# Altium schematic sheet 14. SOC EMIF2 & LPDDR4.SchDoc: LPDDR4 INTERFACE - 3 (part 1 of 2)
size 513 x 386 mm; Project: PROC154E2(001)_SK_AM69; Issue: 1.0; RevCode: E3; Page Create Date: March  8, 1995; Variant Name: Core Design; Schematic Page Number: 14; Page Number: 14; Page Size: C; Comment: MISTRAL_TITLEBLK_CSIZE_1; Page Count: 62; Schematic Page Count: 62; Name: PROC154E2 001 SK AM69; DsnPath: C:\Users\danie\Downloads\sprr466c\PROC154E3_RP\PROC154E3_SCH.DSN; SchematicName: SCHEMATIC1; PageName: 14. SOC EMIF2 & LPDDR4; PageSize: C; TopSchematic: True
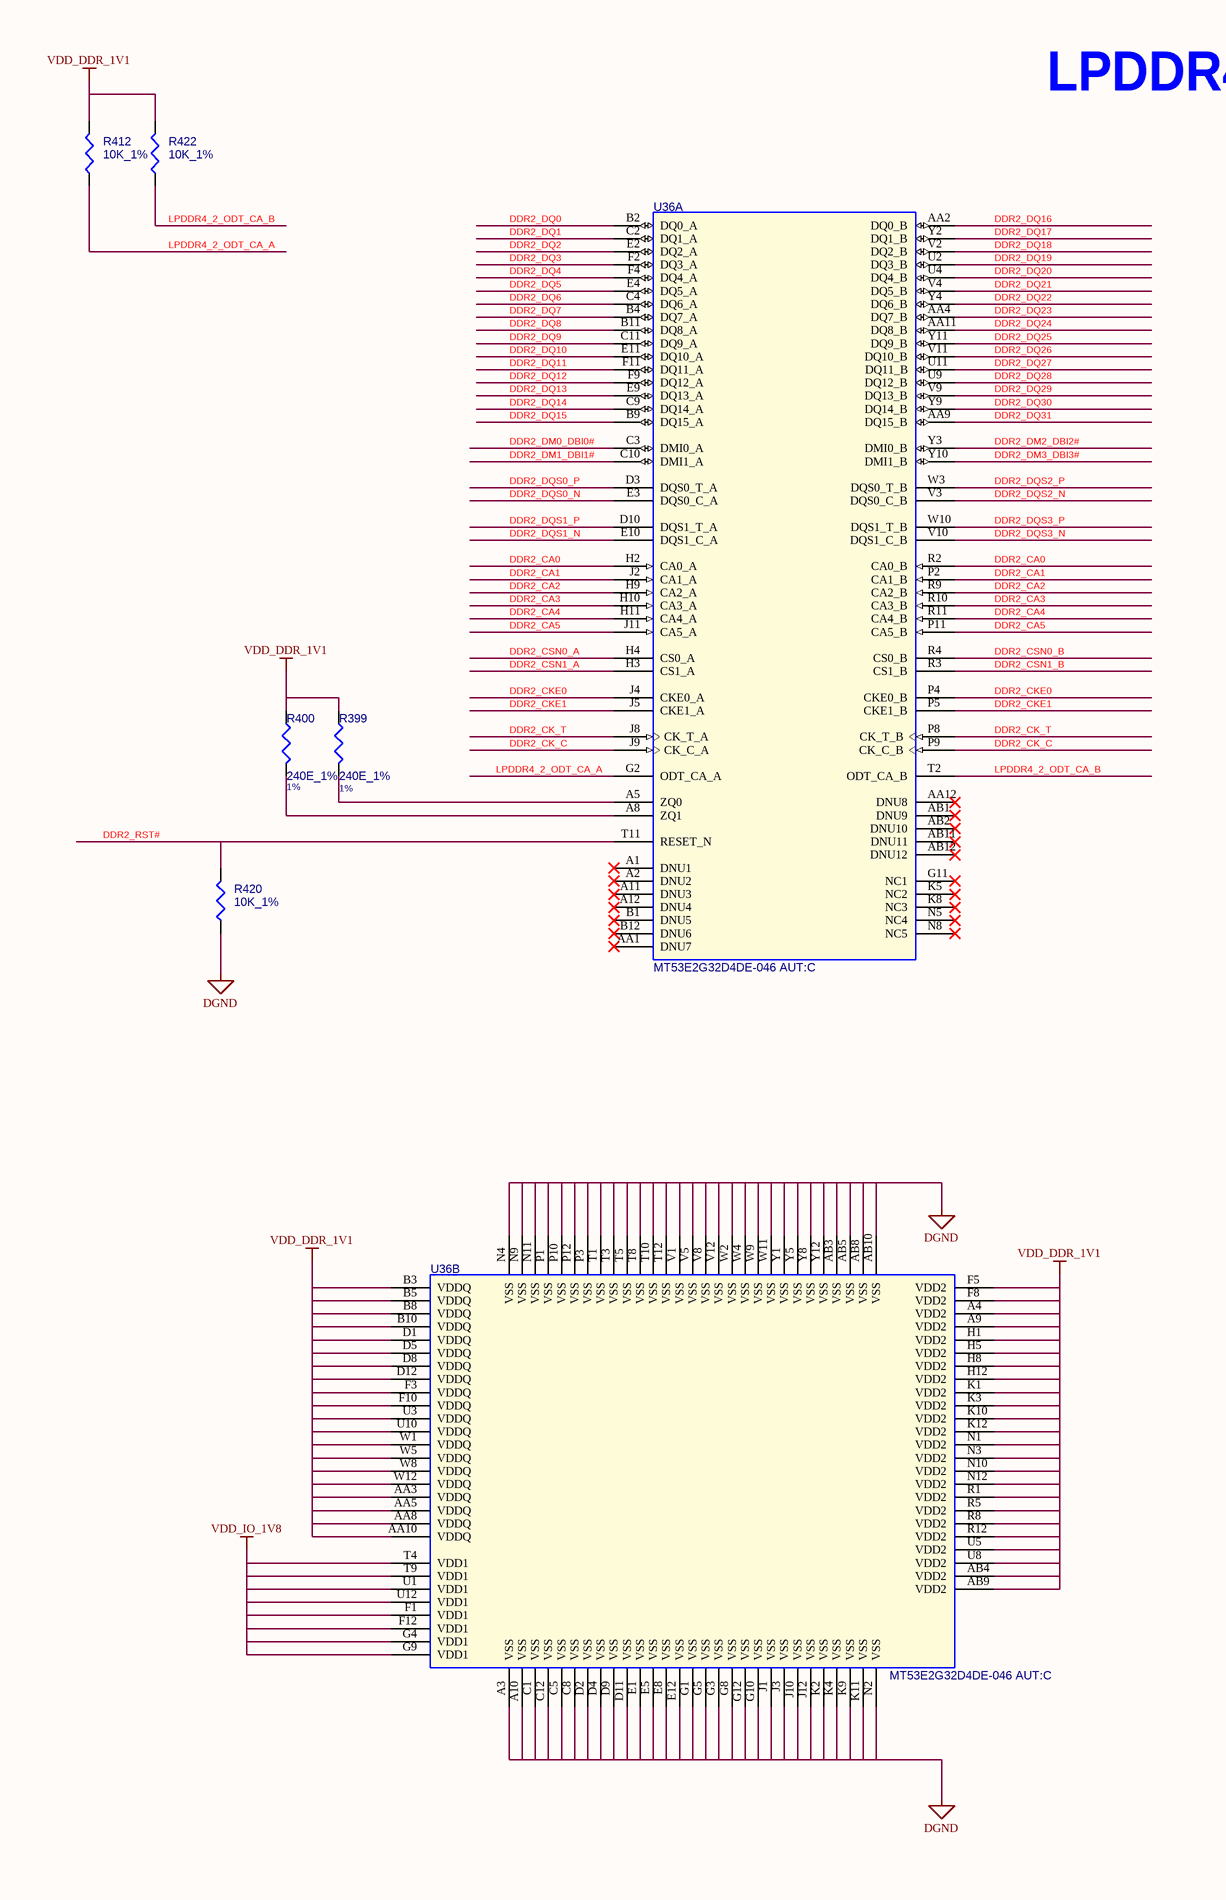
[diagram p0: 14. SOC EMIF2 & LPDDR4.SchDoc, left]
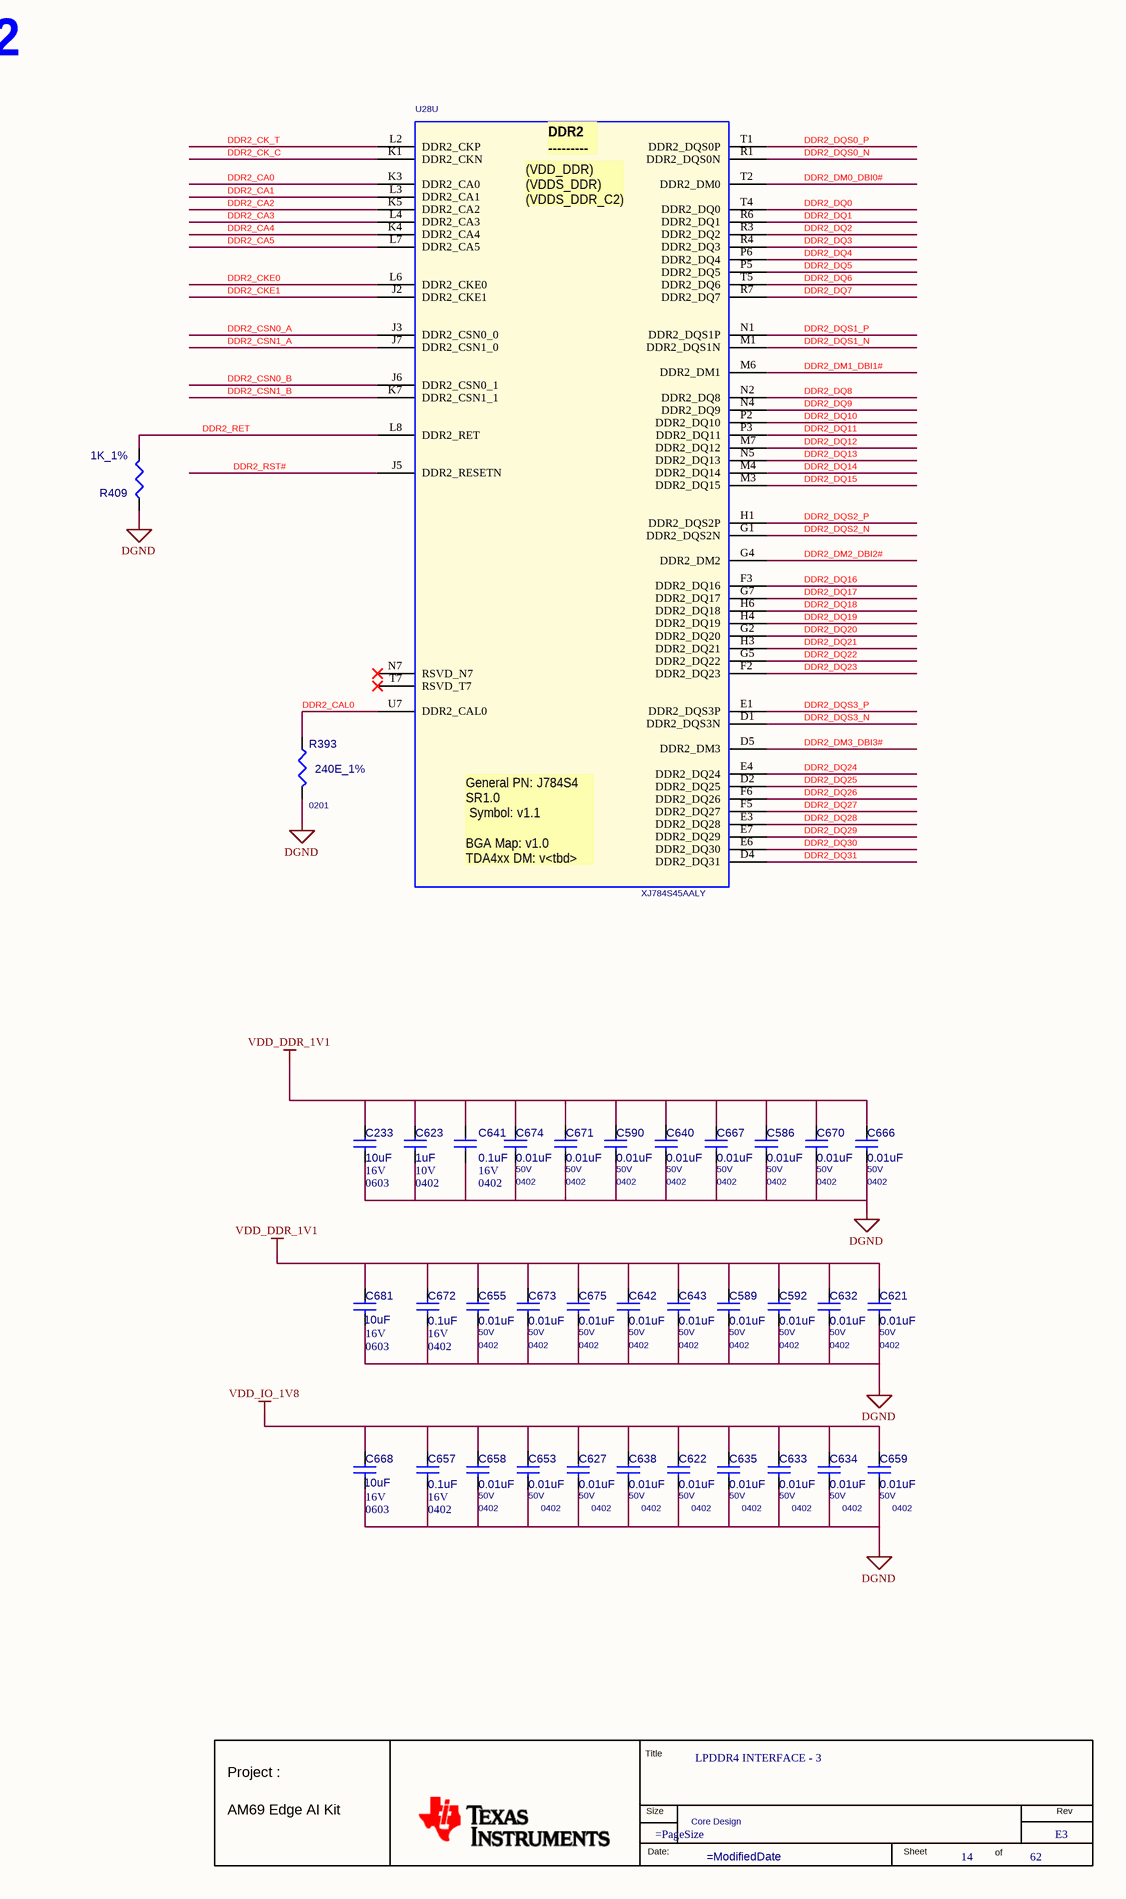
[diagram p1: 14. SOC EMIF2 & LPDDR4.SchDoc, right]

## Parts
*  RevCode: E3  Title: LPDDR4 INTERFACE - 3  Page Number: 14  Page Count: 62  Variant Name: Core Design  (hidden comment: MISTRAL_TITLEBLK_CSIZE_1)  (graphical)
C233  10uF  Package: 0603  Voltage: 16V  [CAP0603_1]
C586  0.01uF  Voltage: 50V  Package: 0402  [CAP0402_0-75]
C589  0.01uF  Voltage: 50V  Package: 0402  [CAP0402_0-75]
C590  0.01uF  Voltage: 50V  Package: 0402  [CAP0402_0-75]
C592  0.01uF  Package: 0402  Voltage: 50V  [CAP0402_0-75]
C621  0.01uF  Package: 0402  Voltage: 50V  [CAP0402_0-75]
C622  0.01uF  Voltage: 50V  Package: 0402  [CAP0402_0-75]
C623  1uF  Voltage: 10V  Package: 0402  [CAP0402_0-75]
C627  0.01uF  Package: 0402  Voltage: 50V  [CAP0402_0-75]
C632  0.01uF  Voltage: 50V  Package: 0402  [CAP0402_0-75]
C633  0.01uF  Voltage: 50V  Package: 0402  [CAP0402_0-75]
C634  0.01uF  Package: 0402  Voltage: 50V  [CAP0402_0-75]
C635  0.01uF  Package: 0402  Voltage: 50V  [CAP0402_0-75]
C638  0.01uF  Package: 0402  Voltage: 50V  [CAP0402_0-75]
C640  0.01uF  Voltage: 50V  Package: 0402  [CAP0402_0-75]
C641  0.1uF  Voltage: 16V  Package: 0402  [CAP0402_0-75]
C642  0.01uF  Package: 0402  Voltage: 50V  [CAP0402_0-75]
C643  0.01uF  Voltage: 50V  Package: 0402  [CAP0402_0-75]
C653  0.01uF  Package: 0402  Voltage: 50V  [CAP0402_0-75]
C655  0.01uF  Package: 0402  Voltage: 50V  [CAP0402_0-75]
C657  0.1uF  Voltage: 16V  Package: 0402  [CAP0402_0-75]
C658  0.01uF  Voltage: 50V  Package: 0402  [CAP0402_0-75]
C659  0.01uF  Voltage: 50V  Package: 0402  [CAP0402_0-75]
C666  0.01uF  Package: 0402  Voltage: 50V  [CAP0402_0-75]
C667  0.01uF  Voltage: 50V  Package: 0402  [CAP0402_0-75]
C668  10uF  Voltage: 16V  Package: 0603  [CAP0603_1]
C670  0.01uF  Voltage: 50V  Package: 0402  [CAP0402_0-75]
C671  0.01uF  Voltage: 50V  Package: 0402  [CAP0402_0-75]
C672  0.1uF  Package: 0402  Voltage: 16V  [CAP0402_0-75]
C673  0.01uF  Package: 0402  Voltage: 50V  [CAP0402_0-75]
C674  0.01uF  Package: 0402  Voltage: 50V  [CAP0402_0-75]
C675  0.01uF  Package: 0402  Voltage: 50V  [CAP0402_0-75]
C681  10uF  Voltage: 16V  Package: 0603  [CAP0603_1]
R393  240E_1%  Package: 0201  [RES0201_0-5]
R399  240E_1%  Tolerance: 1%  [RES0201_0-5]
R400  240E_1%  Tolerance: 1%  [RES0201_0-5]
R409  1K_1%  [RES0402_0-5]
R412  10K_1%  [RES0402_0-5]
R420  10K_1%  [RES0402_0-5]
R422  10K_1%  [RES0402_0-5]
U28  XJ784S45AALY  [BGA1414_31-49_1230X1230_2-7]  (part U of 26)
U36  MT53E2G32D4DE-046 AUT:C  [WFBGA200_MT53DDS_400X570_1-2]  (parts A,B of 2)

## Nets
DGND: C233.2 C586.2 C589.2 C590.2 C592.2 C621.2 C622.2 C623.2 C627.2 C632.2 C633.2 C634.2 C635.2 C638.2 C640.2 C641.2 C642.2 C643.2 C653.2 C655.2 C657.2 C658.2 C659.2 C666.2 C667.2 C668.2 C670.2 C671.2 C672.2 C673.2 C674.2 C675.2 C681.2 R393.2 R409.2 R420.1 U36.A3(VSS) U36.A10(VSS) U36.AB3(VSS) U36.AB5(VSS) U36.AB8(VSS) U36.AB10(VSS) U36.C1(VSS) U36.C5(VSS) U36.C8(VSS) U36.C12(VSS) U36.D2(VSS) U36.D4(VSS) U36.D9(VSS) U36.D11(VSS) U36.E1(VSS) U36.E5(VSS) U36.E8(VSS) U36.E12(VSS) U36.G1(VSS) U36.G3(VSS) U36.G5(VSS) U36.G8(VSS) U36.G10(VSS) U36.G12(VSS) U36.J1(VSS) U36.J3(VSS) U36.J10(VSS) U36.J12(VSS) U36.K2(VSS) U36.K4(VSS) U36.K9(VSS) U36.K11(VSS) U36.N2(VSS) U36.N4(VSS) U36.N9(VSS) U36.N11(VSS) U36.P1(VSS) U36.P3(VSS) U36.P10(VSS) U36.P12(VSS) U36.T1(VSS) U36.T3(VSS) U36.T5(VSS) U36.T8(VSS) U36.T10(VSS) U36.T12(VSS) U36.V1(VSS) U36.V5(VSS) U36.V8(VSS) U36.V12(VSS) U36.W2(VSS) U36.W4(VSS) U36.W9(VSS) U36.W11(VSS) U36.Y1(VSS) U36.Y5(VSS) U36.Y8(VSS) U36.Y12(VSS)
VDD_DDR_1V1: C233.1 C586.1 C589.1 C590.1 C592.1 C621.1 C623.1 C632.1 C640.1 C641.1 C642.1 C643.1 C655.1 C666.1 C667.1 C670.1 C671.1 C672.1 C673.1 C674.1 C675.1 C681.1 R399.1 R400.1 R412.2 R422.2 U36.A4(VDD2) U36.A9(VDD2) U36.AA3(VDDQ) U36.AA5(VDDQ) U36.AA8(VDDQ) U36.AA10(VDDQ) U36.AB4(VDD2) U36.AB9(VDD2) U36.B3(VDDQ) U36.B5(VDDQ) U36.B8(VDDQ) U36.B10(VDDQ) U36.D1(VDDQ) U36.D5(VDDQ) U36.D8(VDDQ) U36.D12(VDDQ) U36.F3(VDDQ) U36.F5(VDD2) U36.F8(VDD2) U36.F10(VDDQ) U36.H1(VDD2) U36.H5(VDD2) U36.H8(VDD2) U36.H12(VDD2) U36.K1(VDD2) U36.K3(VDD2) U36.K10(VDD2) U36.K12(VDD2) U36.N1(VDD2) U36.N3(VDD2) U36.N10(VDD2) U36.N12(VDD2) U36.R1(VDD2) U36.R5(VDD2) U36.R8(VDD2) U36.R12(VDD2) U36.U3(VDDQ) U36.U5(VDD2) U36.U8(VDD2) U36.U10(VDDQ) U36.W1(VDDQ) U36.W5(VDDQ) U36.W8(VDDQ) U36.W12(VDDQ)
VDD_IO_1V8: C622.1 C627.1 C633.1 C634.1 C635.1 C638.1 C653.1 C657.1 C658.1 C659.1 C668.1 U36.F1(VDD1) U36.F12(VDD1) U36.G4(VDD1) U36.G9(VDD1) U36.T4(VDD1) U36.T9(VDD1) U36.U1(VDD1) U36.U12(VDD1)
DDR2_CA0: U28.K3(DDR2_CA0) U36.H2(CA0_A) U36.R2(CA0_B)
DDR2_CA1: U28.L3(DDR2_CA1) U36.J2(CA1_A) U36.P2(CA1_B)
DDR2_CA2: U28.K5(DDR2_CA2) U36.H9(CA2_A) U36.R9(CA2_B)
DDR2_CA3: U28.L4(DDR2_CA3) U36.H10(CA3_A) U36.R10(CA3_B)
DDR2_CA4: U28.K4(DDR2_CA4) U36.H11(CA4_A) U36.R11(CA4_B)
DDR2_CA5: U28.L7(DDR2_CA5) U36.J11(CA5_A) U36.P11(CA5_B)
DDR2_CAL0: R393.1 U28.U7(DDR2_CAL0)
DDR2_CK_C: U28.K1(DDR2_CKN) U36.J9(CK_C_A) U36.P9(CK_C_B)
DDR2_CK_T: U28.L2(DDR2_CKP) U36.J8(CK_T_A) U36.P8(CK_T_B)
DDR2_CKE0: U28.L6(DDR2_CKE0) U36.J4(CKE0_A) U36.P4(CKE0_B)
DDR2_CKE1: U28.J2(DDR2_CKE1) U36.J5(CKE1_A) U36.P5(CKE1_B)
DDR2_CSN0_A: U28.J3(DDR2_CSN0_0) U36.H4(CS0_A)
DDR2_CSN0_B: U28.J6(DDR2_CSN0_1) U36.R4(CS0_B)
DDR2_CSN1_A: U28.J7(DDR2_CSN1_0) U36.H3(CS1_A)
DDR2_CSN1_B: U28.K7(DDR2_CSN1_1) U36.R3(CS1_B)
DDR2_DM0_DBI0#: U28.T2(DDR2_DM0) U36.C3(DMI0_A)
DDR2_DM1_DBI1#: U28.M6(DDR2_DM1) U36.C10(DMI1_A)
DDR2_DM2_DBI2#: U28.G4(DDR2_DM2) U36.Y3(DMI0_B)
DDR2_DM3_DBI3#: U28.D5(DDR2_DM3) U36.Y10(DMI1_B)
DDR2_DQ0: U28.T4(DDR2_DQ0) U36.B2(DQ0_A)
DDR2_DQ1: U28.R6(DDR2_DQ1) U36.C2(DQ1_A)
DDR2_DQ2: U28.R3(DDR2_DQ2) U36.E2(DQ2_A)
DDR2_DQ3: U28.R4(DDR2_DQ3) U36.F2(DQ3_A)
DDR2_DQ4: U28.P6(DDR2_DQ4) U36.F4(DQ4_A)
DDR2_DQ5: U28.P5(DDR2_DQ5) U36.E4(DQ5_A)
DDR2_DQ6: U28.T5(DDR2_DQ6) U36.C4(DQ6_A)
DDR2_DQ7: U28.R7(DDR2_DQ7) U36.B4(DQ7_A)
DDR2_DQ8: U28.N2(DDR2_DQ8) U36.B11(DQ8_A)
DDR2_DQ9: U28.N4(DDR2_DQ9) U36.C11(DQ9_A)
DDR2_DQ10: U28.P2(DDR2_DQ10) U36.E11(DQ10_A)
DDR2_DQ11: U28.P3(DDR2_DQ11) U36.F11(DQ11_A)
DDR2_DQ12: U28.M7(DDR2_DQ12) U36.F9(DQ12_A)
DDR2_DQ13: U28.N5(DDR2_DQ13) U36.E9(DQ13_A)
DDR2_DQ14: U28.M4(DDR2_DQ14) U36.C9(DQ14_A)
DDR2_DQ15: U28.M3(DDR2_DQ15) U36.B9(DQ15_A)
DDR2_DQ16: U28.F3(DDR2_DQ16) U36.AA2(DQ0_B)
DDR2_DQ17: U28.G7(DDR2_DQ17) U36.Y2(DQ1_B)
DDR2_DQ18: U28.H6(DDR2_DQ18) U36.V2(DQ2_B)
DDR2_DQ19: U28.H4(DDR2_DQ19) U36.U2(DQ3_B)
DDR2_DQ20: U28.G2(DDR2_DQ20) U36.U4(DQ4_B)
DDR2_DQ21: U28.H3(DDR2_DQ21) U36.V4(DQ5_B)
DDR2_DQ22: U28.G5(DDR2_DQ22) U36.Y4(DQ6_B)
DDR2_DQ23: U28.F2(DDR2_DQ23) U36.AA4(DQ7_B)
DDR2_DQ24: U28.E4(DDR2_DQ24) U36.AA11(DQ8_B)
DDR2_DQ25: U28.D2(DDR2_DQ25) U36.Y11(DQ9_B)
DDR2_DQ26: U28.F6(DDR2_DQ26) U36.V11(DQ10_B)
DDR2_DQ27: U28.F5(DDR2_DQ27) U36.U11(DQ11_B)
DDR2_DQ28: U28.E3(DDR2_DQ28) U36.U9(DQ12_B)
DDR2_DQ29: U28.E7(DDR2_DQ29) U36.V9(DQ13_B)
DDR2_DQ30: U28.E6(DDR2_DQ30) U36.Y9(DQ14_B)
DDR2_DQ31: U28.D4(DDR2_DQ31) U36.AA9(DQ15_B)
DDR2_DQS0_N: U28.R1(DDR2_DQS0N) U36.E3(DQS0_C_A)
DDR2_DQS0_P: U28.T1(DDR2_DQS0P) U36.D3(DQS0_T_A)
DDR2_DQS1_N: U28.M1(DDR2_DQS1N) U36.E10(DQS1_C_A)
DDR2_DQS1_P: U28.N1(DDR2_DQS1P) U36.D10(DQS1_T_A)
DDR2_DQS2_N: U28.G1(DDR2_DQS2N) U36.V3(DQS0_C_B)
DDR2_DQS2_P: U28.H1(DDR2_DQS2P) U36.W3(DQS0_T_B)
DDR2_DQS3_N: U28.D1(DDR2_DQS3N) U36.V10(DQS1_C_B)
DDR2_DQS3_P: U28.E1(DDR2_DQS3P) U36.W10(DQS1_T_B)
DDR2_RET: R409.1 U28.L8(DDR2_RET)
DDR2_RST#: R420.2 U28.J5(DDR2_RESETN) U36.T11(RESET_N)
LPDDR4_2_ODT_CA_A: R412.1 U36.G2(ODT_CA_A)
LPDDR4_2_ODT_CA_B: R422.1 U36.T2(ODT_CA_B)
NetR399_2: R399.2 U36.A5(ZQ0)
NetR400_2: R400.2 U36.A8(ZQ1)

Not connected (* = marked no-connect by the designer): U28 N7(RSVD_N7)* T7(RSVD_T7)*; U36 A1(DNU1)* A2(DNU2)* A11(DNU3)* A12(DNU4)* AA1(DNU7)* AA12(DNU8)* AB1(DNU9)* AB2(DNU10)* AB11(DNU11)* AB12(DNU12)* B1(DNU5)* B12(DNU6)* G11(NC1)* K5(NC2)* K8(NC3)* N5(NC4)* N8(NC5)*

## Notes on the sheet
- LPDDR4 - DDR2
- (in symbol J7AHPSoC-EVM_BGA1414, part U) DDR2 / ---------; (VDD_DDR) / (VDDS_DDR) / (VDDS_DDR_C2); General PN: J784S4 / SR1.0 / Symbol: v1.1 / BGA Map: v1.0 / TDA4xx DM: v<tbd>
- (in symbol MISTRAL_TITLEBLK_CSIZE_1) Title; Project :; Size; Rev; AM69 Edge AI Kit; Date:; Sheet; of